# Altium schematic sheet Sheet1.SchDoc
size A4; SheetNumber: 1; SheetTotal: 1
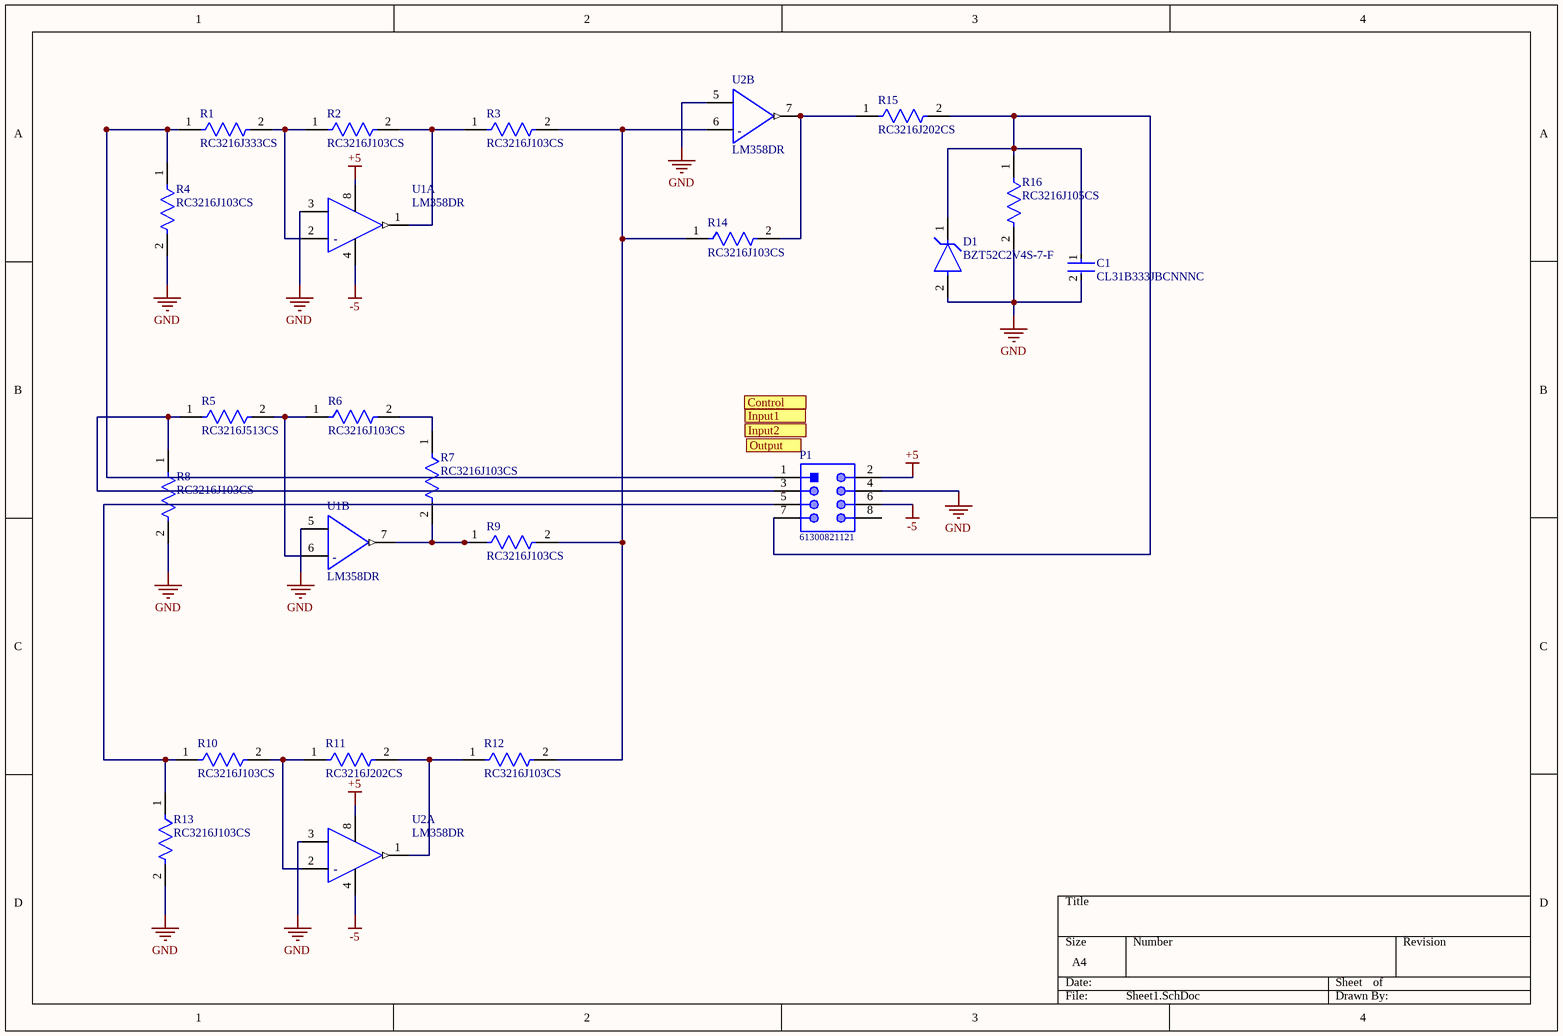
[diagram p0: Sheet1.SchDoc]

## Parts
C1  CL31B333JBCNNNC  [FP-CL31-IPC_C]
D1  BZT52C2V4S-7-F  [FP-SOD323-IPC_B]
P1  61300821121  [61300821121]
R1  RC3216J333CS  [FP-RC3216-IPC_A]
R2  RC3216J103CS  [FP-RC3216-IPC_C]
R3  RC3216J103CS  [FP-RC3216-IPC_C]
R4  RC3216J103CS  [FP-RC3216-IPC_C]
R5  RC3216J513CS  [FP-RC3216-IPC_A]
R6  RC3216J103CS  [FP-RC3216-IPC_C]
R7  RC3216J103CS  [FP-RC3216-IPC_C]
R8  RC3216J103CS  [FP-RC3216-IPC_C]
R9  RC3216J103CS  [FP-RC3216-IPC_C]
R10  RC3216J103CS  [FP-RC3216-IPC_C]
R11  RC3216J202CS  [FP-RC3216-IPC_A]
R12  RC3216J103CS  [FP-RC3216-IPC_C]
R13  RC3216J103CS  [FP-RC3216-IPC_C]
R14  RC3216J103CS  [FP-RC3216-IPC_C]
R15  RC3216J202CS  [FP-RC3216-IPC_A]
R16  RC3216J105CS  [FP-RC3216-MFG]
U1  LM358DR  [FP-D0008A-MFG]  (parts A,B of 2)
U2  LM358DR  [FP-D0008A-MFG]  (parts A,B of 2)

## Ports
Control, Input1, Input2, Output

## Nets
+5: P1.2 U1.8(V+) U2.8(V+)
-5: P1.6 U1.4(V-) U2.4(V-)
GND: C1.2 D1.2(A) P1.4 R4.2 R8.2 R13.2 R16.2 U1.3(IN1+) U1.5(IN2+) U2.3(IN1+) U2.5(IN2+)
NetC1_1: C1.1 D1.1(C) P1.7 R15.2 R16.1
NetP1_1: P1.1 R1.1 R4.1
NetP1_3: P1.3 R5.1 R8.1
NetP1_5: P1.5 R10.1 R13.1
NetR1_2: R1.2 R2.1 U1.2(IN1-)
NetR2_2: R2.2 R3.1 U1.1(1OUT)
NetR3_2: R3.2 R9.2 R12.2 R14.1 U2.6(IN2-)
NetR5_2: R5.2 R6.1 U1.6(IN2-)
NetR6_2: R6.2 R7.1
NetR7_2: R7.2 R9.1 U1.7(2OUT)
NetR10_2: R10.2 R11.1 U2.2(IN1-)
NetR11_2: R11.2 R12.1 U2.1(1OUT)
NetR14_2: R14.2 R15.1 U2.7(2OUT)

Not connected (* = marked no-connect by the designer): P1 8

## Notes on the sheet
- (in symbol CMP-1685-00009-2, part A) -
- (in symbol CMP-1685-00009-2, part B) -

## Library data of the parts
C1 = CMP-13271-004295-1: Cap Ceramic 33nF 50V X7R ±5% SMD 1206 +125°C Embossed T/R; Voltage Rating: 50V; Dielectric: X7R; Mount: Surface Mount; Height: 0.85mm; Depth: 1.6mm; Min Operating Temperature: -55°C; Capacitance: 33nF; Radiation Hardening: No; Packaging: Tape and Reel; Case/Package: 1206; RoHS Compliant: Yes; Case Code (Imperial): 1206; Voltage: 50V; Package Quantity: 1; Thickness: 0.039inch; Case Code (Metric): 3216; Voltage Rating (DC): 50V; Length: 3.2mm; Lead Free: Lead Free; Width: 0.063inch; Series: CL; Construction: Flat; Max Operating Temperature: 125°C; Tolerance: 5%
D1 = CMP-12792-000028-1: DIODE ZENER 2.4V 200MW SOD323; Impedance: 100R; Zener Current: 5mA; Max Reverse Leakage Current: 50uA; ESD Protection: No; Output Current: 50mA; Tolerance: 8%; Element Configuration: Single; Number of Pins: 2; Max Operating Temperature: 150°C; Contact Plating: Tin; Min Operating Temperature: -65°C; REACH SVHC: No SVHC; Power Dissipation: 200mW; Test Current: 5mA; Peak Reverse Current: 50uA; Height: 1mm; Radiation Hardening: No; Termination: SMD/SMT; Power Rating: 200mW; Package Quantity: 3000; Zener Voltage: 2.4V; Max Power Dissipation: 200mW; Lead Free: Lead Free; Weight: 0.000173oz; Width: 1.4mm; Voltage Tolerance: 8%; Voltage Rating (DC): 2.4V; Packaging: Tape and Reel; Mount: Surface Mount; Length: 1.8mm
P1 = CMP-1502-01078-1: THT Vertical Pin Header WR-PHD, Pitch 2.54 mm, Dual Row, 8 pins; Manufacturer: Wurth Elektronik; Contact Resistance: 20mOhm; Rated Current: 3A; Working Voltage: 250VAC; Pin Number: 8; Withstanding Voltage: 500VAC; Pitch: 2.54mm; Gender: Male; Datasheet URL: https://katalog.we-online.de/em/datasheet/6130xx21121.pdf; Package Reference: 61300821121; Orientation: Vertical; Part Number: 61300821121; Publisher: WurthElektronik; Mounting Technology: THT; Manufacturer URL: http://www.we-online.de; Packaging: Bag; Row Number: Dual; Operating Temperature: -40to105degC
R1 = CMP-13261-004051-1: Res Thick Film 1206 33kΩ 5% 0.25W ±100ppm/°C Molded SMD T/R; Voltage Rating (DC): 200V; Resistance: 33kR; Max Power Dissipation: 250mW; Packaging: Tape and Reel; Temperature Coefficient: 100ppm/°C; Tolerance: 5%; Lead Free: Lead Free; Case Code (Metric): 3216; Case/Package: 1206; Features: Moisture Resistant; Radiation Hardening: No; Length: 0.126inch; Contact Plating: Tin; Width: 0.063inch; Height: 0.026inch; Min Operating Temperature: -55°C; Composition: Thick Film; Max Operating Temperature: 155°C; Number of Terminations: 2; Case Code (Imperial): 1206; Power Rating: 250mW
R2-R4 R6-R10 R12-R14 = CMP-13261-005388-1: Res Thick Film 1206 10kΩ 5% 0.25W ±100ppm/°C Molded SMD T/R; Resistance: 10kR; Voltage Rating (DC): 200V; Max Power Dissipation: 250mW; Case Code (Metric): 3216; Radiation Hardening: No; Contact Plating: Tin; Packaging: Tape and Reel; Case Code (Imperial): 1206; Composition: Thick Film; Height: 0.026inch; Features: Moisture Resistant; Temperature Coefficient: 100ppm/°C; Tolerance: 5%; Length: 0.126inch; Min Operating Temperature: -55°C; Depth: 1.6mm; Case/Package: 1206; Number of Terminations: 2; Width: 0.063inch; Lead Free: Lead Free; Military Standard: Not; Max Operating Temperature: 155°C
R5 = CMP-13261-005323-1: Res Thick Film 1206 51kΩ 5% 0.25W ±100ppm/°C Molded SMD T/R; Power Rating: 250mW; Voltage Rating (DC): 200V; Resistance: 51kR; Height: 0.026inch; Case Code (Imperial): 1206; Length: 0.126inch; Composition: Thick Film; Packaging: Tape and Reel; Features: Moisture Resistant; Width: 0.063inch; Temperature Coefficient: 100ppm/°C; Min Operating Temperature: -55°C; Case/Package: 1206; Max Operating Temperature: 155°C; Tolerance: 5%; Lead Free: Lead Free; Contact Plating: Tin; Case Code (Metric): 3216; Number of Terminations: 2; Radiation Hardening: No; Max Power Dissipation: 250mW
R11 R15 = CMP-13261-004107-1: Res Thick Film 1206 2kΩ 5% 0.25W ±100ppm/°C Molded SMD T/R; Voltage Rating (DC): 200V; Resistance: 2kR; Max Power Dissipation: 250mW; Features: Moisture Resistant; Min Operating Temperature: -55°C; Radiation Hardening: No; Lead Free: Lead Free; Height: 0.026inch; Tolerance: 5%; Case/Package: 1206; Case Code (Metric): 3216; Max Operating Temperature: 155°C; Case Code (Imperial): 1206; Length: 0.126inch; Contact Plating: Tin; Temperature Coefficient: 100ppm/°C; Packaging: Tape and Reel; Depth: 1.6mm; Composition: Thick Film; Number of Terminations: 2; Width: 0.063inch
R16 = CMP-13261-004533-1: Res Thick Film 1206 1MΩ 5% 0.25W ±100ppm/°C Molded SMD T/R; Max Power Dissipation: 250mW; Voltage Rating (DC): 200V; Resistance: 1MR; Contact Plating: Tin; Radiation Hardening: No; Packaging: Tape and Reel; Number of Terminations: 2; Max Operating Temperature: 155°C; Case Code (Imperial): 1206; Length: 0.126inch; Width: 0.063inch; Tolerance: 5%; Depth: 1.6mm; Case Code (Metric): 3216; Lead Free: Lead Free; Height: 0.026inch; Package Quantity: 1; Military Standard: Not; Case/Package: 1206; Min Operating Temperature: -55°C; Features: Moisture Resistant; Composition: Thick Film; Temperature Coefficient: 100ppm/°C
U1 U2 = CMP-1685-00009-2: IC OPAMP GP 2 CIRCUIT 8SOIC; Output Current: 30mA; Min Dual Supply Voltage: 1.5V; Input Offset Voltage (Vos): 7mV; Power Supply Rejection Ratio (PSRR): 65dB; Unity Gain Bandwidth Product: 700kHz; Number of Channels: 2; Min Supply Voltage: 3V; Max Dual Supply Voltage: 16V; Dual Supply Voltage: 9V; Max Supply Voltage: 32V; Nominal Supply Current: 1.2mA; Slew Rate: 0.3V/µs; Input Bias Current: 250nA; Voltage Gain: 100dB; Operating Supply Current: 1mA; REACH SVHC: No SVHC; Package Quantity: 2500; Width: 3.91mm; Max Operating Temperature: 70°C; Min Operating Temperature: 0°C; Mount: Surface Mount; Length: 4.9mm; Radiation Hardening: No; Case/Package: SOIC; Lead Free: Lead Free; Number of Elements: 2; Packaging: Tape and Reel; Output Current per Channel: 30mA; Number of Circuits: 2; Bandwidth: 700kHz; Operating Supply Voltage: 16V; Gain Bandwidth Product: 700kHz; Number of Pins: 8; Number of Amplifiers: 2; Height: 1.58mm; Common Mode Rejection Ratio: 65dB; Contact Plating: Gold